# Altium schematic sheet Filtros.SchDoc: Electronica de Potencia
size A4; CompanyName: UTN FRBA; SheetNumber: 3; SheetTotal: 5
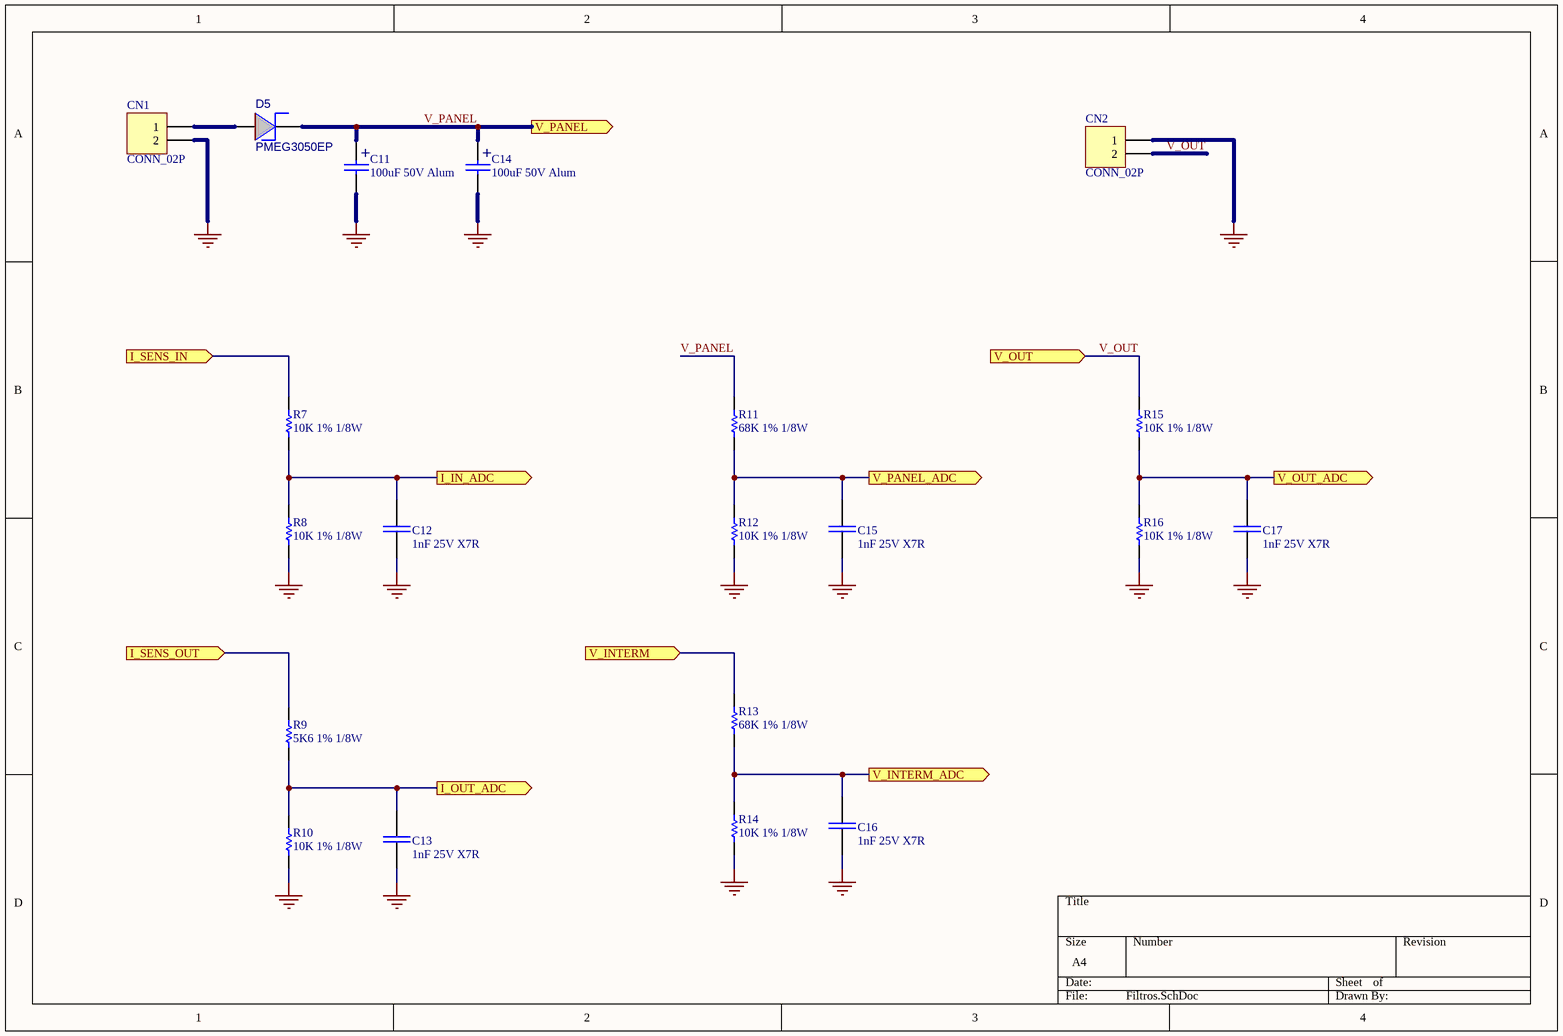
[diagram p0: Filtros.SchDoc]

## Parts
C11  100uF 50V Alum  [CAPSMD8x8.3]
C12  1nF 25V X7R  [0805]
C13  1nF 25V X7R  [0805]
C14  100uF 50V Alum  [CAPSMD8x8.3]
C15  1nF 25V X7R  [0805]
C16  1nF 25V X7R  [0805]
C17  1nF 25V X7R  [0805]
CN1  CONN_02P  [Bornera2_DegsonH]
CN2  CONN_02P  [Bornera2_DegsonH]
D5  PMEG3050EP  [SOD-128]
R7  10K 1% 1/8W  [0805]
R8  10K 1% 1/8W  [0805]
R9  5K6 1% 1/8W  [0805]
R10  10K 1% 1/8W  [0805]
R11  68K 1% 1/8W  [0805]
R12  10K 1% 1/8W  [0805]
R13  68K 1% 1/8W  [0805]
R14  10K 1% 1/8W  [0805]
R15  10K 1% 1/8W  [0805]
R16  10K 1% 1/8W  [0805]

## Ports
I_IN_ADC (out, see MainSCH[2B], Microcontrolador[3A]), I_OUT_ADC (out, see MainSCH[2B], Microcontrolador[3A]), I_SENS_IN (in, see MainSCH[2B], Bucks[2A]), I_SENS_OUT (in, see MainSCH[2B], Bucks[4C]), V_INTERM (in, see MainSCH[2B], Bucks[4B]), V_INTERM_ADC (out, see MainSCH[2B], Microcontrolador[3A]), V_OUT (in, see MainSCH[2B], Bucks[4C]), V_OUT_ADC (out, see MainSCH[2B], Microcontrolador[3A]), V_PANEL (out, see MainSCH[2B], Bucks[1A], Fuentes[1B]), V_PANEL_ADC (out, see MainSCH[2B], Microcontrolador[3A])

## Nets
GND: C11.2 C12.2 C13.2 C14.2 C15.2 C16.2 C17.2 CN1.2 CN2.1 R8.1 R10.1 R12.1 R14.1 R16.1
I_IN_ADC: C12.1 R7.1 R8.2 ; port I_IN_ADC
I_OUT_ADC: C13.1 R9.1 R10.2 ; port I_OUT_ADC
I_SENS_IN: R7.2 ; port I_SENS_IN
I_SENS_OUT: R9.2 ; port I_SENS_OUT
V_INTERM: R13.2 ; port V_INTERM
V_INTERM_ADC: C16.1 R13.1 R14.2 ; port V_INTERM_ADC
V_OUT: CN2.2 R15.2 ; port V_OUT
V_OUT_ADC: C17.1 R15.1 R16.2 ; port V_OUT_ADC
V_PANEL: C11.1 C14.1 D5.2(K) R11.2 ; port V_PANEL
V_PANEL_ADC: C15.1 R11.1 R12.2 ; port V_PANEL_ADC
NetCN1_1: CN1.1 D5.1(A)

## Notes on the sheet
- (in symbol CAPPOL) +

## Library data of the parts
C11 C14 = CAPPOL: UWZ1H101MCL1GS
C12 C13 C15-C17 = Ceramic capacitor
CN1 CN2 = CONN_02P: Connector Generic 2 Vias
D5 = DIODO_SH: Diode Shottky
R7-R16 = RES